# EAGLE design controller_pcb (EAGLE 7.5.0)
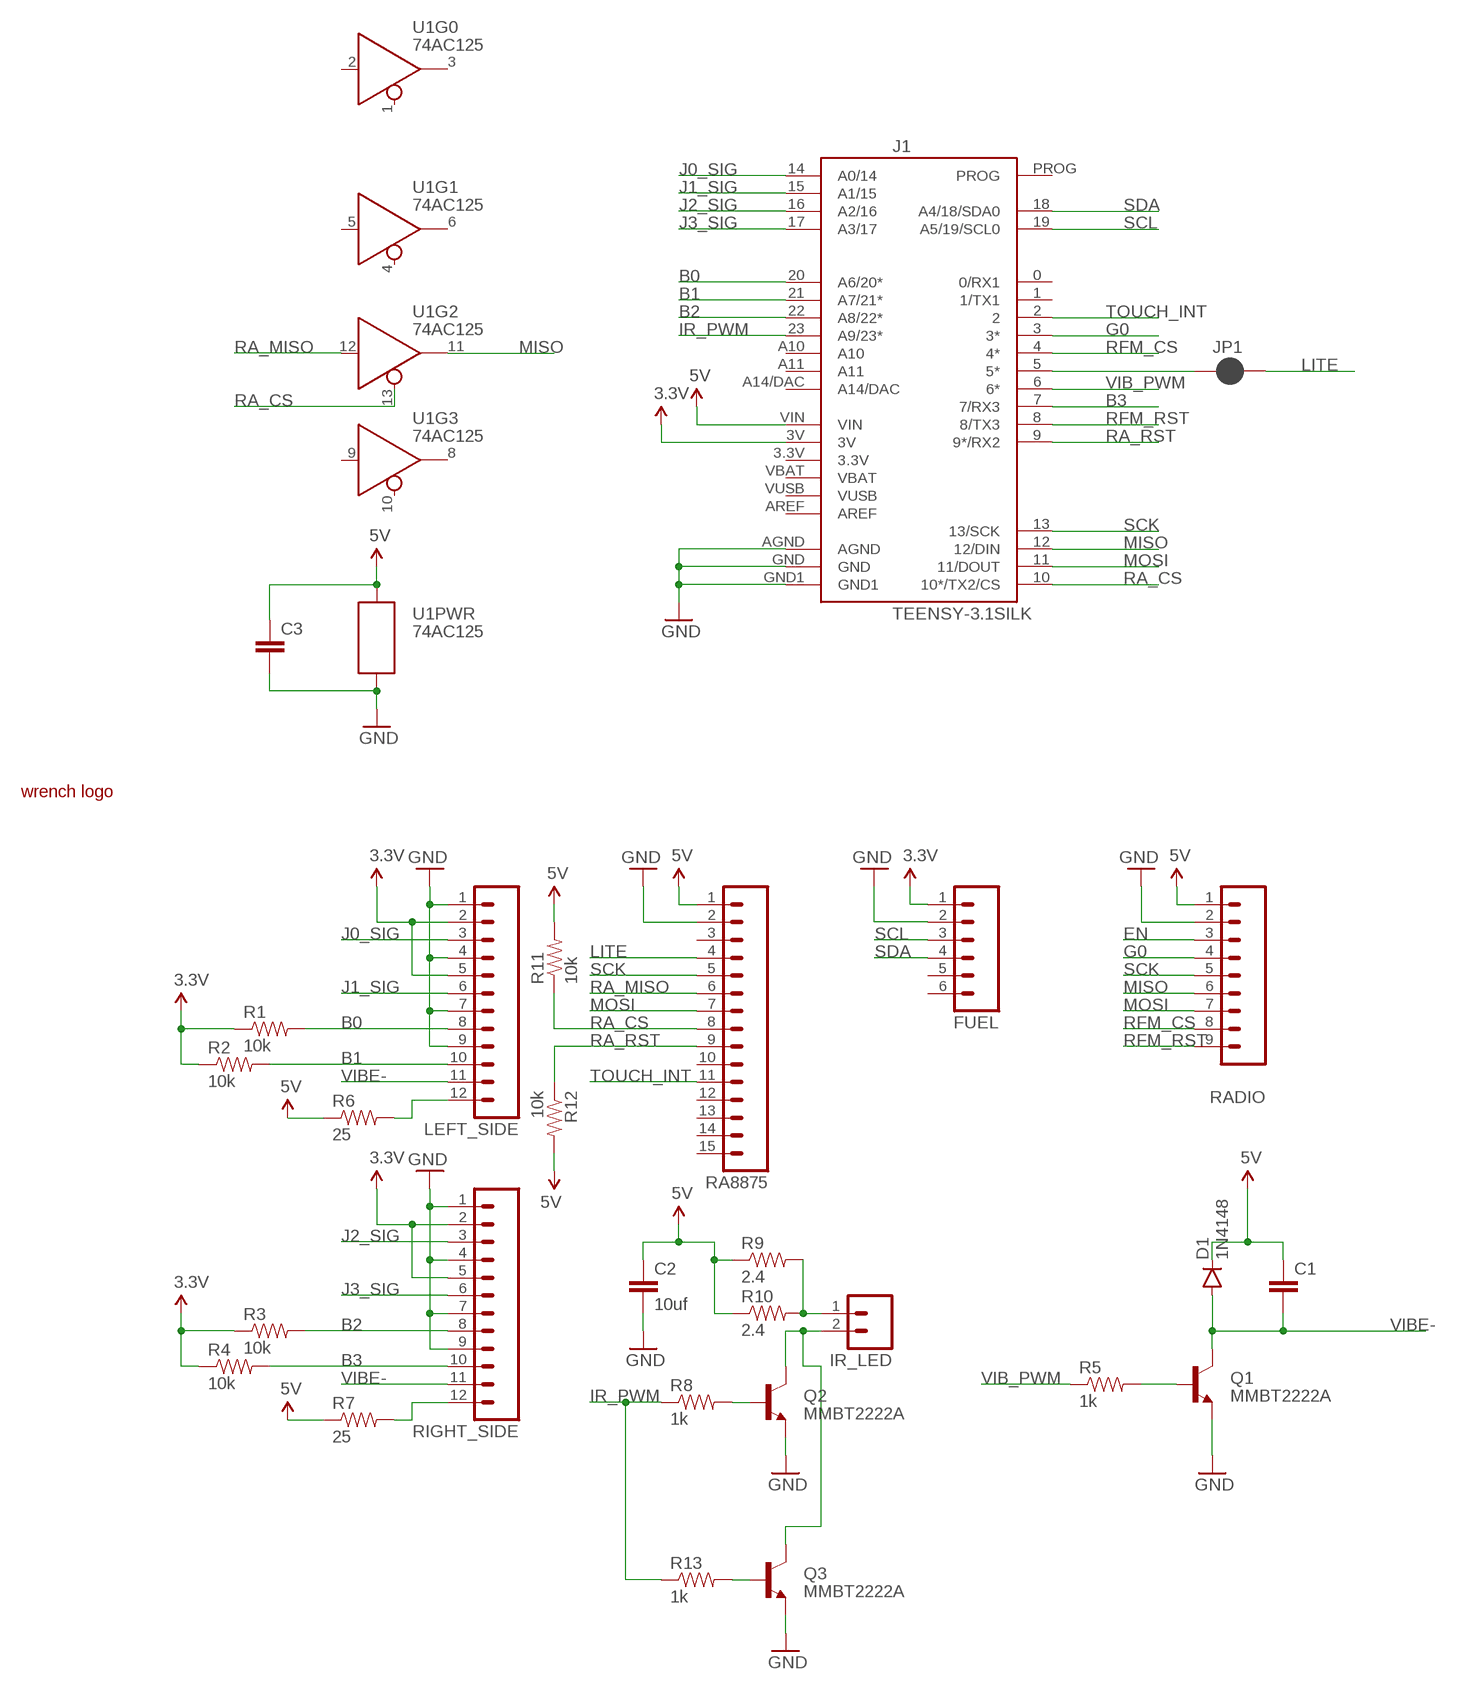
[diagram p0: schematic, sheet 1]

## Parts
C1  CAP0805  [0805]
C2  10uf  CAP1206  [1206]
C3  CAP0805  [0805]
D1  1N4148  DIODE1N4148  [DIODE-1N4148]
FUEL  M06LOCK_LONGPADS  [1X06_LOCK_LONGPADS]
IR_LED  M02PTH3  [1X02_LONGPADS]
J1  TEENSY-3.1SILK  [TEENSY-3.1]
JP1  JUMPER-PAD-2-NC_BY_PASTE  [PAD-JUMPER-2-NC_BY_PASTE_YES_SILK]
LEFT_SIDE  M12LONGPADS  [1X12_LONGPADS]
Q1  MMBT2222A  TRANSISTOR_NPNMMBT2222A  [SOT23-3]
Q2  MMBT2222A  TRANSISTOR_NPNMMBT2222A  [SOT23-3]
Q3  MMBT2222A  TRANSISTOR_NPNMMBT2222A  [SOT23-3]
R1  10k  RESISTOR0805-RES  [0805]
R2  10k  RESISTOR0805-RES  [0805]
R3  10k  RESISTOR0805-RES  [0805]
R4  10k  RESISTOR0805-RES  [0805]
R5  1k  RESISTOR0805-RES  [0805]
R6  25  RESISTOR0805-RES  [0805]
R7  25  RESISTOR0805-RES  [0805]
R8  1k  RESISTOR0805-RES  [0805]
R9  2.4  RESISTORPTH-1/2W  [AXIAL-0.5]
R10  2.4  RESISTORPTH-1/2W  [AXIAL-0.5]
R11  10k  RESISTOR0805-RES  [0805]
R12  10k  RESISTOR0805-RES  [0805]
R13  1k  RESISTOR0805-RES  [0805]
RA8875  M15LOCK_LONGPADS  [1X15_LOCK_LONGPADS]
RADIO  M09LOCK-LONGPADS  [1X09_LOCK_LONGPADS]
RIGHT_SIDE  M12LONGPADS  [1X12_LONGPADS]
U1  74AC125  74AC125DG125  [SO14]
U$1  SMALL  [WRENCHLOGO]

## Nets
3.3V: FUEL.1 J1.3V LEFT_SIDE.2 LEFT_SIDE.5 R1.1 R2.1 R3.1 R4.1 RIGHT_SIDE.2 RIGHT_SIDE.5
5V: C1.1 C2.1 C3.1 D1.C J1.VIN R6.1 R7.1 R9.P$1 R10.P$1 R11.2 R12.2 RA8875.1 RADIO.1 U1.14(PWR:P$V+)
B0: J1.20(A6/20*) LEFT_SIDE.8 R1.2
B1: J1.21(A7/21*) LEFT_SIDE.10 R2.2
B2: J1.22(A8/22*) R3.2 RIGHT_SIDE.8
B3: J1.7(7/RX3) R4.2 RIGHT_SIDE.10
EN: RADIO.3
G0: J1.3(3*) RADIO.4
GND: C2.2 C3.2 FUEL.2 J1.AGND J1.GND J1.GND1 LEFT_SIDE.1 LEFT_SIDE.4 LEFT_SIDE.7 LEFT_SIDE.9 Q1.2(E) Q2.2(E) Q3.2(E) RA8875.2 RADIO.2 RIGHT_SIDE.1 RIGHT_SIDE.4 RIGHT_SIDE.7 RIGHT_SIDE.9 U1.7(PWR:P$V-)
IR_PWM: J1.23(A9/23*) R8.1 R13.1
J0_SIG: J1.14(A0/14) LEFT_SIDE.3
J1_SIG: J1.15(A1/15) LEFT_SIDE.6
J2_SIG: J1.16(A2/16) RIGHT_SIDE.3
J3_SIG: J1.17(A3/17) RIGHT_SIDE.6
LITE: JP1.2 RA8875.4
MISO: J1.12(12/DIN) RADIO.6 U1.11(Q)
MOSI: J1.11(11/DOUT) RA8875.7 RADIO.7
N$1: J1.5(5*) JP1.1
N$2: R7.2 RIGHT_SIDE.12
N$3: LEFT_SIDE.12 R6.2
N$4: Q1.1(B) R5.2
N$5: IR_LED.2 Q2.3(C) Q3.3(C)
N$6: Q2.1(B) R8.2
N$7: IR_LED.1 R9.P$2 R10.P$2
N$9: Q3.1(B) R13.2
RA_CS: J1.10(10*/TX2/CS) R11.1 RA8875.8 U1.13(!EN)
RA_MISO: RA8875.6 U1.12(D)
RA_RST: J1.9(9*/RX2) R12.1 RA8875.9
RFM_CS: J1.4(4*) RADIO.8
RFM_RST: J1.8(8/TX3) RADIO.9
SCK: J1.13(13/SCK) RA8875.5 RADIO.5
SCL: FUEL.3 J1.19(A5/19/SCL0)
SDA: FUEL.4 J1.18(A4/18/SDA0)
TOUCH_INT: J1.2 RA8875.11
VIB_PWM: J1.6(6*) R5.1
VIBE-: C1.2 D1.A LEFT_SIDE.11 Q1.3(C) RIGHT_SIDE.11
Unconnected: FUEL.5 FUEL.6 J1.0(0/RX1) J1.1(1/TX1) J1.3.3V J1.A10 J1.A11 J1.A14/DAC J1.AREF J1.PROG J1.VBAT J1.VUSB RA8875.3 RA8875.10 RA8875.12 RA8875.13 RA8875.14 RA8875.15 U1.1(!EN) U1.2(D) U1.3(Q) U1.4(!EN) U1.5(D) U1.6(Q) U1.8(Q) U1.9(D) U1.10(!EN)

## Library data of the parts
C1-C3 = SparkFun-Capacitors:CAP: Capacitor Standard 0603 ceramic capacitor, and 0.1" leaded capacitor.
D1 = SparkFun-DiscreteSemi:DIODE: Diode These are standard reverse protection diodes and small signal diodes. SMA package can handle up to about 1A. SOD-323 can handle about 200mA. What the SOD-323 package when ordering, there are some mfgs out there that are 5-pin packages.; PROD_ID: DIO-08378
FUEL = SparkFun-Connectors:M06: Header 6 Standard 6-pin 0.1" header. Use with straight break away headers (SKU : PRT-00116), right angle break away headers (PRT-00553), swiss pins (PRT-00743), machine pins (PRT-00117), and female headers (PRT-00115). Molex polarized connector foot print use with SKU : PRT-08094 with associated crimp pins and housings. NOTES ON THE VARIANTS LOCK and LOCK_LONGPADS... This footprint was designed to help hold the alignment of a through-hole component (i.e. 6-pin header) while soldering it into place. You may notice that each hole has been shifted either up or down by 0.005 of an inch from it's more standard position (which is a perfectly straight line). This slight alteration caused the pins (the squares in the middle) to touch the edges of the holes. Because they are alternating, it causes a "brace" to hold the component in place. 0.005 has proven to be the perfect amount of "off-center" position when using our standard breakaway headers. Although looks a little odd when you look at the bare footprint, once you have a header in there, the alteration is very hard to notice. Also,if you push a header all the way into place, it is covered up entirely on the bottom side. This idea of altering the position of holes to aid alignment will be further integrated into the Sparkfun Library for other footprints. It can help hold any component with 3 or more connection pins.
IR_LED = SparkFun-Connectors:M02: Standard 2-pin 0.1" header. Use with - straight break away headers ( PRT-00116) - right angle break away headers (PRT-00553) - swiss pins (PRT-00743) - machine pins (PRT-00117) - female headers (PRT-00115) Molex polarized connector foot print use with: PRT-08233 with associated crimp pins and housings. 2.54_SCREWTERM for use with PRT-10571. 3.5mm Screw Terminal footprints for PRT-08084 5mm Screw Terminal footprints for use with PRT-08432
J1 = SparkFun-Boards:TEENSY-3.1; SF_ID: DEV-12646
JP1 = SparkFun-Passives:JUMPER-PAD-2-NC_BY_PASTE
LEFT_SIDE RIGHT_SIDE = SparkFun-Connectors:M12: Header 12 Standard 12-pin 0.1" header. Use with straight break away headers (SKU : PRT-00116), right angle break away headers (PRT-00553), swiss pins (PRT-00743), machine pins (PRT-00117), and female headers (PRT-00115).
Q1-Q3 = SparkFun-DiscreteSemi:TRANSISTOR_NPN: Generic NPN BJT MMBT2222A - TRANS-08049 (SOT-23, 1A 40V) MPSA42 - TRANS-09116 (SOT-23, 500mA 300V) MMBT5088LT1G - TRANS-11160 (SOT-23, 50 mA 30V) BC547 - COM-08928 <http://www.sparkfun.com/products/8928> (TO-92 45V 100mA) (1.Collector 2.Base 3.Emitter) 2N3904 - COM-00521 <http://www.sparkfun.com/products/521> (TO-92 40V 200mA) (1.Emitter 2.Base 3.Collector) P2N2222A - COM-12852 <http://www.sparkfun.com/products/12852> (TO-92 40V 600mA) (1.Collector 2.Base 3.Emitter); PROD_ID: TRANS-08049
R1-R13 = SparkFun-Passives:RESISTOR: Resistor Basic schematic elements and footprints for 0603, 1206, and PTH resistors.
RA8875 = SparkFun-Connectors:M15: Header 15 Standard 15-pin 0.1" header. Use with straight break away headers (SKU : PRT-00116), right angle break away headers (PRT-00553), swiss pins (PRT-00743), machine pins (PRT-00117), and female headers (PRT-00115).
RADIO = SparkFun-Connectors:M09: Header 9 Standard 9-pin 0.1" header. Use with straight break away headers (SKU : PRT-00116), right angle break away headers (PRT-00553), swiss pins (PRT-00743), machine pins (PRT-00117), and female headers (PRT-00115).
U1 = SparkFun-DigitalIC:74*125; PROD_ID: IC-08880
U$1 = logos-and-graphics:SMALL

## Board
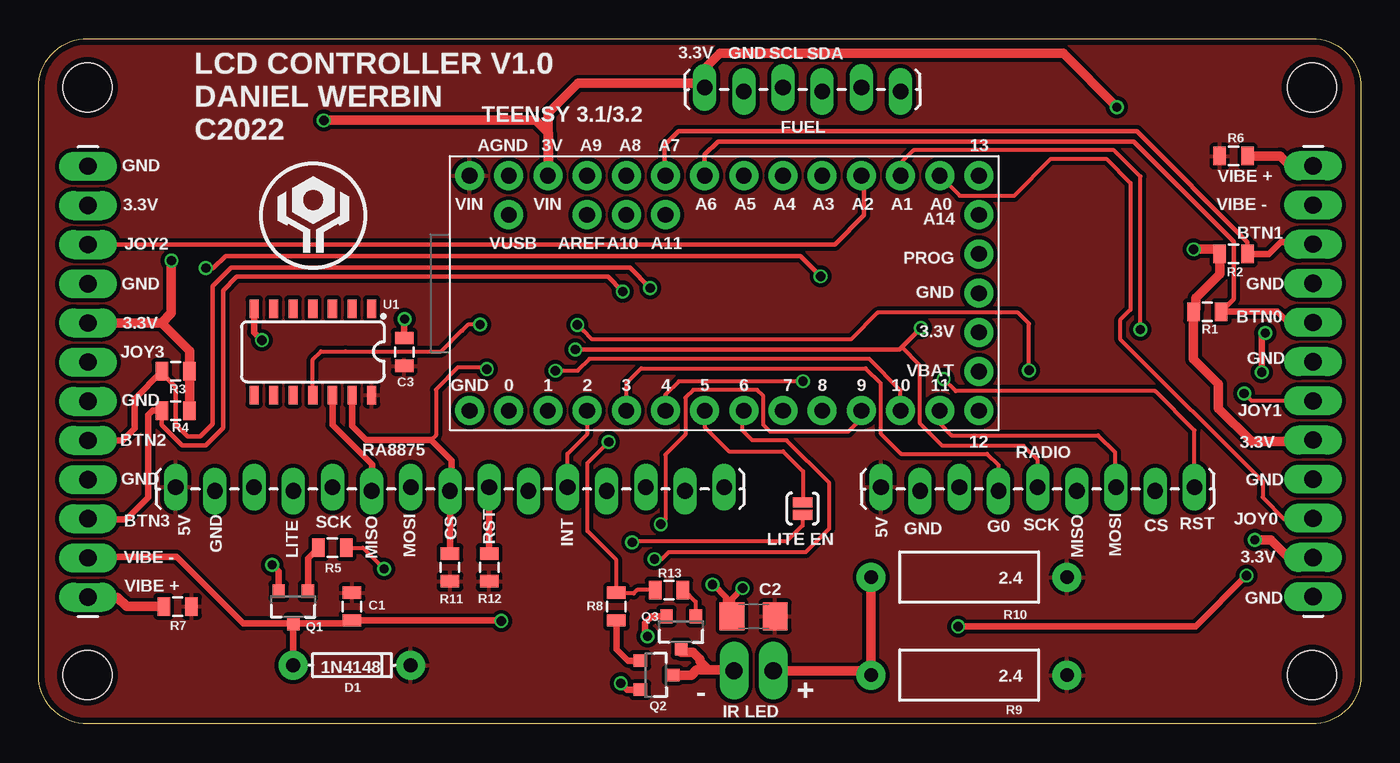
[diagram p1: board, top side]
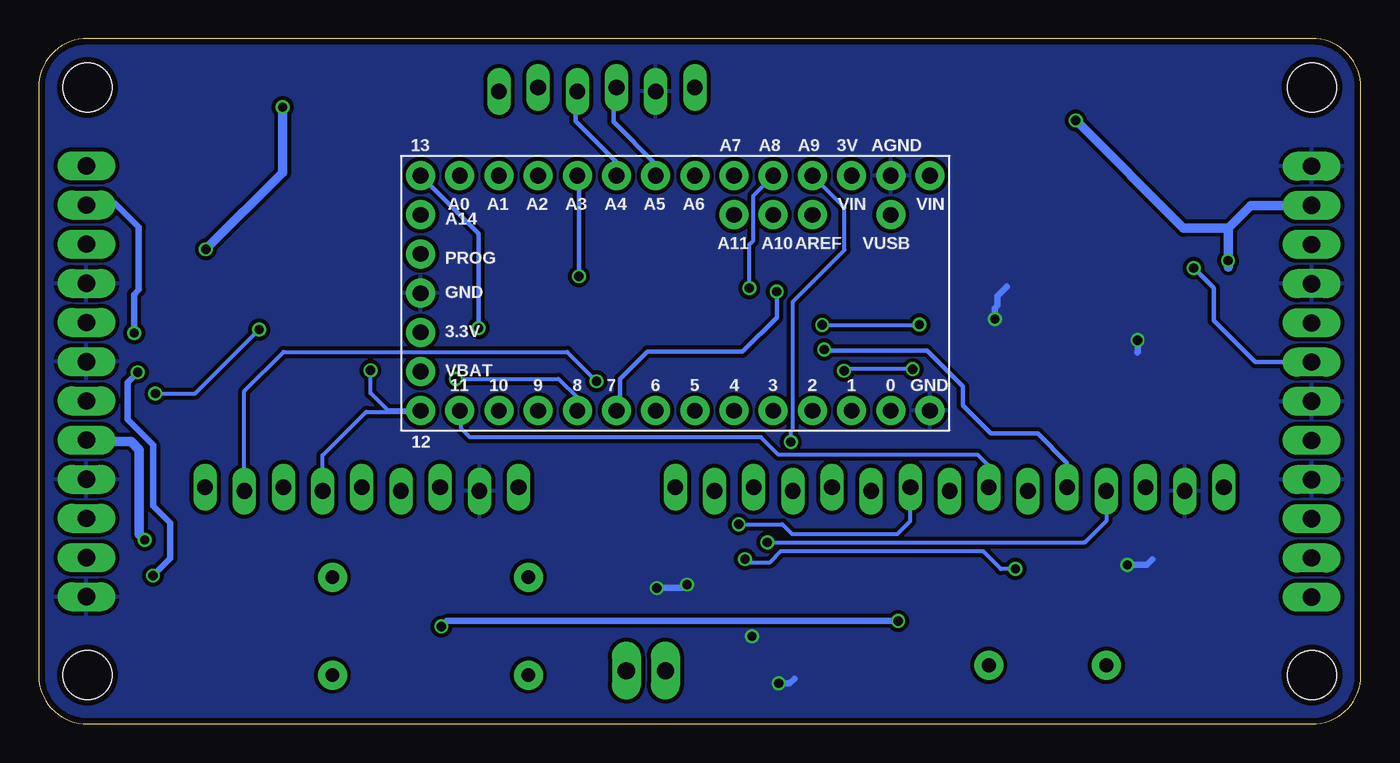
[diagram p2: board, bottom side, seen from below]

Size 85.72 x 44.45 mm. Coordinates in mm from the lower left corner, seen from the top.
Outline: 3.17,0 arc-90 0,3.17 0,41.27 arc-90 3.17,44.45 82.55,44.45 arc-90 85.72,41.27 85.72,3.17 arc-90 82.55,0 3.17,0
Copper layers (1*16): Top 0.035559375mm / dielectric 1.6mm / Bottom 0.035559375mm
Design rules "oshpark-2layer": minimum track width 6mil, minimum drill 10mil, track to track 6mil, track to pad 6mil, pad to pad 6mil, via to via 6mil, smd to smd 6mil, copper to edge 15mil, drill to drill 6mil, minimum pad ring 5mil, minimum via ring 5mil, stop-mask expansion 2.5mil, vias tented up to drill 0mil, thermal gap 10mil
Holes 3.17 mm at 3.17,41.27 3.17,3.17 82.55,3.17 82.55,41.27

### Footprints (pad centres in the part's own frame; a part is rotated, then mirrored left to right if it is on the bottom)
0805 = smd 0.8 x 1.2: 1 -0.9,0; 2 0.9,0
1206 = smd 1.6 x 1.8: 1 -1.4,0; 2 1.4,0
DIODE-1N4148 = drill 0.9 pad 1.88: A -3.81,0; C 3.81,0
1X06_LOCK_LONGPADS = drill 1.016 long: 1 0,0; 2 2.54,-0.254; 3 5.08,0; 4 7.62,-0.254; 5 10.16,0; 6 12.7,-0.254
1X02_LONGPADS = drill 1.118 pad 1.88 long: 1 0,0; 2 2.54,0
TEENSY-3.1 = drill 1.016 pad 1.88: 0 16.51,3.81; 1 16.51,6.35; 2 16.51,8.89; 3 16.51,11.43; 3.3V 11.43,34.29; 3V 1.27,6.35; 4 16.51,13.97; 5 16.51,16.51; 6 16.51,19.05; 7 16.51,21.59; 8 16.51,24.13; 9 16.51,26.67; 10 16.51,29.21; 11 16.51,31.75; 12 16.51,34.29; 13 1.27,34.29; 14 1.27,31.75; 15 1.27,29.21; 16 1.27,26.67; 17 1.27,24.13; 18 1.27,21.59; 19 1.27,19.05; 20 1.27,16.51; 21 1.27,13.97; 22 1.27,11.43; 23 1.27,8.89; A10 3.81,11.43; A11 3.81,13.97; A14/DAC 3.81,34.29; AGND 1.27,3.81; AREF 3.81,8.89; GND 8.89,34.29; GND1 16.51,1.27; PROG 6.35,34.29; VBAT 13.97,34.29; VIN 1.27,1.27; VUSB 3.81,3.81
PAD-JUMPER-2-NC_BY_PASTE_YES_SILK = smd 0.635 x 1.27: 1 -0.401,0; 2 0.413,0
1X12_LONGPADS = drill 1.118 pad 1.88 long: 1 0,0; 2 2.54,0; 3 5.08,0; 4 7.62,0; 5 10.16,0; 6 12.7,0; 7 15.24,0; 8 17.78,0; 9 20.32,0; 10 22.86,0; 11 25.4,0; 12 27.94,0
SOT23-3 = smd 0.8 x 0.9: 1 -0.95,-1; 2 0.95,-1; 3 0,1.1
AXIAL-0.5 = drill 0.9 pad 1.88: P$1 -6.35,0; P$2 6.35,0
1X15_LOCK_LONGPADS = drill 1.016 long: 1 0,0.127; 2 2.54,-0.127; 3 5.08,0.127; 4 7.62,-0.127; 5 10.16,0.127; 6 12.7,-0.127; 7 15.24,0.127; 8 17.78,-0.127; 9 20.32,0.127; 10 22.86,-0.127; 11 25.4,0.127; 12 27.94,-0.127; 13 30.48,0.127; 14 33.02,-0.127; 15 35.56,0.127
1X09_LOCK_LONGPADS = drill 1.016 long: 1 0,0.127; 2 2.54,-0.127; 3 5.08,0.127; 4 7.62,-0.127; 5 10.16,0.127; 6 12.7,-0.127; 7 15.24,0.127; 8 17.78,-0.127; 9 20.32,0.127
SO14 = smd 0.6 x 1.2: 1 -3.81,-2.8; 2 -2.54,-2.8; 3 -1.27,-2.8; 4 0,-2.8; 5 1.27,-2.8; 6 2.54,-2.8; 7 3.81,-2.8; 8 3.81,2.8; 9 2.54,2.8; 10 1.27,2.8; 11 0,2.8; 12 -1.27,2.8; 13 -2.54,2.8; 14 -3.81,2.8

### Placement (x,y rotation side)
C1  20.32,7.62 270 top
C2  46.35,6.98 180 top
C3  23.7,24.13 90 top
D1  20.32,3.81 0 top
FUEL  43.18,41.27 0 top
IR_LED  47.62,3.45 180 top
J1  26.67,36.83 270 top
JP1  49.53,13.97 270 top
LEFT_SIDE  82.63,8.25 90 top
Q1  16.51,7.62 180 top
Q2  40.01,3.17 270 top
Q3  41.66,5.99 180 top
R1  75.77,26.75 0 top
R2  77.47,30.48 0 top
R3  8.89,22.86 180 top
R4  8.89,20.32 180 top
R5  19.05,11.43 180 top
R6  77.47,36.83 0 top
R7  9.02,7.62 180 top
R8  37.47,7.62 270 top
R9  60.33,3.17 180 top
R10  60.33,9.52 180 top
R11  26.67,10.16 270 top
R12  29.21,10.16 270 top
R13  40.87,8.69 0 top
RA8875  8.89,15.24 0 top
RADIO  54.61,15.24 0 top
RIGHT_SIDE  3.2,36.17 270 top
U1  17.78,24.13 180 top
U$1  13.97,29.21 0 top

### Tracks (layer width: path | path; a pad name or v marks a point on that pad's centre or on a via)
3.3V  (via drill 0.6)
  Top 0.61: 7.98,26.01 9.79,24.2 R3.1 R4.1 | v18.49,39.14 32.23,39.14 33.05,38.33 33.05,35.59 J1.3V 33.02,39.6 34.98,41.55 42.9,41.55 FUEL.1 43.18,42.49 44.17,43.48 66.42,43.48 v69.9,40 | v74.88,30.79 76.27,30.79 R2.1 76.57,29.17 75.03,27.63 75.03,26.91 R1.1 74.87,23.66 76.48,22.05 76.48,20.47 78.64,18.31 82.53,18.31 LEFT_SIDE.5 | v78.84,11.94 79.88,11.94 81.2,10.62 82.45,10.62 LEFT_SIDE.2 | 7.98,26.01 RIGHT_SIDE.5 | v8.61,30.05 8.61,26.64 7.98,26.01
  Bottom 0.61: 8.59,32.16 7.14,33.6 4.22,33.6 4.14,33.68 3.25,33.68 RIGHT_SIDE.2 | 8.59,32.16 11.51,32.16 v18.49,39.14 | v69.9,40 69.9,35.76 v74.88,30.79 | LEFT_SIDE.5 82.53,18.31 79.73,18.31 79.2,17.78 79.2,12.29 v78.84,11.94 | 8.59,32.16 8.59,29.64 v8.61,30.05
5V
  pour Top (isolate 0.254): 1.27,0 0,1.27 0,43.18 1.27,44.45 85.09,44.45 86.36,43.18 86.36,1.27 85.09,0
B0
  Top 0.305: J1.20 43.18,36.91 44.04,37.77 71.02,37.77 77.5,31.29 77.5,27.55 R1.2
  Top 0.406: R1.2 80.29,26.75 81.08,25.96 82.55,25.96 LEFT_SIDE.8
B1
  Top 0.305: R2.2 78.37,31.26 71.2,38.43 41.48,38.43 40.59,37.54 40.59,35.61 J1.21
  Top 0.406: R2.2 79.76,30.48 80.54,31.27 82.47,31.27 LEFT_SIDE.10
B2  (via drill 0.6)
  Top 0.305: R3.2 7.99,22.77 8.89,21.87 8.89,19.41 9.65,18.64 10.49,18.64 11.3,19.46 11.3,28.4 12.5,29.59 38.33,29.59 v39.65,28.27
  Top 0.406: RIGHT_SIDE.8 5.46,18.39 6.22,19.15 6.22,21.09 R3.2
  Bottom 0.254: v39.65,28.27 39.65,31.09 39.4,31.34 39.4,34.27 J1.22
B3  (via drill 0.6)
  Top 0.305: R4.2 7.99,19.39 9.32,18.06 10.82,18.06 11.96,19.2 11.96,28.12 12.85,29.01 36.91,29.01 v37.87,28.04
  Top 0.406: R4.2 7.39,20.32 7.11,20.04 7.11,14.71 5.69,13.28 3.23,13.28 RIGHT_SIDE.10
  Bottom 0.305: v37.87,28.04 37.87,26.36 40.08,24.16 46.25,24.16 48.03,22.38 48.03,20.55 J1.7
G0
  Top 0.254: J1.3 38.1,22.1 39.06,23.06 53.62,23.06 54.59,22.1 54.59,18.85 55.91,17.53 61.49,17.53 62.23,16.79 RADIO.4
GND  (via drill 0.6)
  Top 0.406: U1.7 13.97,25.4 v14.48,24.89 | C3.2 23.7,26.24 v23.72,26.26 | Q1.2 15.56,9.89 v15.14,10.31 | C2.2 44.95,8.12 v45.64,8.81 | v43.69,9.04 43.76,9.04 44.58,8.23 44.58,7.21 44.86,6.93 | Q2.2 38.16,2.22 v37.74,2.64 | Q3.2 39.76,6.99 39.32,6.55 39.32,5.84 v39.47,5.69
  Bottom 0.406: v14.48,24.89 14.48,24.13 14.5,24.1 | v23.72,26.26 23.72,26.98 23.57,27.13 23.57,27.76 22.96,28.37 | v15.14,10.31 13.87,10.31 13.51,10.67 | v45.64,8.81 43.92,8.81 v43.69,9.04 | v37.74,2.64 37.03,2.64 36.73,2.95 | v39.47,5.69 39.45,5.69 39.29,5.54
  pour Bottom (isolate 0.254): 2.54,0 1.27,0 0,1.27 0,43.18 1.27,44.45 85.09,44.45 86.36,43.18 86.36,1.27 85.09,0
IR_PWM  (via drill 0.6)
  Top 0.254: v36.96,18.29 35.59,16.92 35.59,12.52 37.47,10.64 R8.1 37.53,8.46 38.58,8.46 38.81,8.69 R13.1
  Bottom 0.254: v36.96,18.29 36.96,18.97 36.83,19.1 36.83,27.38 33.48,30.73 33.48,33.48 J1.23
J0_SIG
  Top 0.254: J1.14 59.72,34.27 63.25,34.27 65.63,36.65 69.22,36.65 70.79,35.08 70.79,26.87 70.1,26.19 70.1,24.97 79.35,15.72 79.35,14.71 80.77,13.28 82.58,13.28 LEFT_SIDE.3
J1_SIG  (via drill 0.6)
  Top 0.254: LEFT_SIDE.6 78.64,20.95 v78.16,21.44 | v71.42,25.58 71.42,35.51 69.72,37.21 56.72,37.21 55.93,36.42 55.93,35.61 J1.15
  Bottom 0.254: v78.16,21.44 75.56,21.44 v71.42,25.58
J2_SIG
  Top 0.305: RIGHT_SIDE.3 51.61,31.09 53.52,33 53.52,34.9 53.7,35.08 53.7,35.2 J1.16
J3_SIG  (via drill 0.6)
  Top 0.305: v10.85,29.57 11.33,29.57 12.12,30.35 49.38,30.35 v50.7,29.03
  Bottom 0.305: RIGHT_SIDE.6 6.86,23.47 9.55,26.16 9.55,28.27 v10.85,29.57 | v50.7,29.03 50.7,35.46 J1.17
LITE  (via drill 0.6)
  Top 0.254: JP1.2 49.53,12.88 48.49,11.84 38.53,11.84 v38.48,11.79
  Bottom 0.254: v38.48,11.79 17.91,11.79 16.48,13.21 16.48,15.62 16.51,15.65 RA8875.4
MISO  (via drill 0.6)
  Top 0.254: v64.21,22.94 64.21,25.96 63.5,26.67 54.38,26.67 52.65,24.94 35.89,24.94 35.33,25.5 35.31,25.5 v34.92,25.88 | v28.63,25.91 27.91,25.91 27.89,25.93 27.46,25.5 27.43,25.5 26.06,24.13 19.91,24.13 19.89,24.16 18.31,24.16 17.78,23.62 U1.11
  Bottom 0.254: RADIO.6 67.31,17.42 64.49,20.24 61.04,20.24 J1.12 63.07,20.32 64.21,21.46 v64.21,22.94 | v34.92,25.88 28.65,25.88 v28.63,25.91
MOSI
  Top 0.254: J1.11 58.42,19.48 59.18,18.72 68.68,18.72 69.77,17.63 69.77,15.44 RADIO.7
  Bottom 0.254: RA8875.7 24.13,16.74 24.84,17.45 37.74,17.45 38.89,18.59 57.76,18.59 58.32,19.15 58.32,20.22 J1.11
N$1
  Top 0.254: J1.5 43.18,19.25 44.76,17.68 48.26,17.68 49.55,16.38 49.55,14.4 JP1.1
N$2
  Top 0.61: RIGHT_SIDE.12 5.11,8.23 5.71,7.62 R7.2
N$3
  Top 0.61: R6.2 80.49,36.83 81.28,36.04 82.47,36.04 LEFT_SIDE.12
N$4
  Top 0.406: Q1.1 17.46,10.74 R5.2
N$5
  Top 0.406: Q3.3 41.66,4.65
  Top 0.61: Q2.3 42.32,3.17 42.65,3.5 43.43,3.5 | 43.43,3.5 45.03,3.5 IR_LED.2 | 41.66,4.65 42.42,4.65 42.88,4.19 42.88,4.06 43.43,3.5
N$6
  Top 0.406: R8.2 37.47,4.85 38.2,4.11 38.99,4.11 Q2.1
N$7
  Top 0.61: IR_LED.1 53.7,3.45 R9.P$2 R10.P$2
N$9
  Top 0.254: R13.2 41.83,8.69 42.6,7.92 42.6,7 Q3.1
RA_CS  (via drill 0.6)
  Top 0.254: J1.10 55.88,21.64 53.85,23.67 35.71,23.67 34.95,22.91 v33.5,22.91 | 25.45,18.41 25.76,18.72 25.76,21.69 27.2,23.14 28.93,23.14 v29.06,23.01
  Top 0.406: U1.13 20.32,19.33 21.23,18.41 25.45,18.41 26.77,17.09 26.77,15.21 RA8875.8 R11.1
  Bottom 0.254: v29.06,23.01 33.4,23.01 v33.5,22.91
RA_MISO
  Top 0.406: U1.12 19.05,19.41 21.61,16.84 21.61,15.14 RA8875.6
RA_RST  (via drill 0.6)
  Top 0.254: J1.9 53.34,19.81 52.48,18.95 47.45,18.95 46.99,19.41 46.99,21.26 46.58,21.67 42.44,21.67 41.94,21.16 41.94,18.77 40.64,17.48 40.64,13.26 v40.34,12.95
  Top 0.406: R12.1 RA8875.9
  Bottom 0.254: v40.34,12.95 37.52,12.95 36.88,12.32 30.05,12.32 29.21,13.16 RA8875.9
RFM_CS  (via drill 0.6)
  Top 0.254: v49.55,22.23 41.5,22.23 40.64,21.36 J1.4
  Bottom 0.254: RADIO.8 72.39,21.59 69.85,24.13 51.46,24.13 v49.55,22.23
RFM_RST  (via drill 0.6)
  Top 0.254: RADIO.9 74.93,19.05 72.39,21.59 59.46,21.59 v58.67,22.38
  Bottom 0.254: v58.67,22.38 52.02,22.38 50.8,21.16 J1.8 | J1.8 50.8,19.76 50.7,19.66 50.7,20.22 J1.8
SCK  (via drill 0.6)
  Top 0.254: RADIO.5 64.77,17.12 63.86,18.03 58.6,18.03 57.15,19.48 57.15,23.24 55.96,24.43
  Top 0.305: v34.8,24.28 55.8,24.28 55.96,24.43 v57.2,25.68
  Bottom 0.305: RA8875.5 19.05,16.94 20.95,18.85 24,18.85 25.81,20.65 25.81,21.89 28.14,24.23 34.75,24.23 v34.8,24.28 | v57.2,25.68 57.2,31.8 J1.13
SCL
  Bottom 0.305: J1.19 45.72,36.32 48.46,39.06 48.46,41.07 FUEL.3
SDA
  Bottom 0.305: J1.18 48.26,36.45 50.9,39.09 50.9,40.92 FUEL.4
TOUCH_INT
  Top 0.254: RA8875.11 34.29,17.53 35.59,18.82 35.59,20.29 J1.2
VIB_PWM  (via drill 0.6)
  Top 0.254: R5.1 21.03,11.43 v22.4,10.06 | v39.93,10.69 40.41,10.69 40.87,11.15 49.73,11.15 51.26,12.67 51.26,15.62 48.49,18.39 46.28,18.39 45.64,19.02 45.64,20.24 J1.6
  Bottom 0.254: v22.4,10.06 23.34,10.06 24.49,11.2 37.62,11.2 38.35,10.46 39.7,10.46 v39.93,10.69
VIBE-  (via drill 0.6)
  Top 0.406: D1.A Q1.3 | Q1.3 13.27,6.52 8.94,10.85 3.28,10.85 RIGHT_SIDE.11 | Q1.3 20.12,6.52 C1.2 29.96,6.72 v30,6.68 | v59.61,6.32 75.01,6.32 v78.31,9.63 | v79.3,22.81 79.3,25.12 v79.53,25.35
  Bottom 0.406: v30,6.68 59.26,6.68 v59.61,6.32 | LEFT_SIDE.11 82.8,33.48 83.21,33.48 83.08,33.6 82.07,33.6 81.92,33.76 80.77,33.76 79.22,32.21 79.22,28.17 79.53,27.86 v79.53,25.35 | v79.3,22.81 79.96,22.15 79.96,19.74 78.31,18.09 78.31,14.15 77.19,13.03 77.19,10.74 v78.31,9.63

### Text on the board
tPlace: 3.3V | GND | SCL | SDA | TEENSY 3.1/3.2 | FUEL | LCD CONTROLLER V1.0 / DANIEL WERBIN / C2022 | R6 | GND | VIBE + | 3.3V | VIBE - | BTN1 | JOY2 | R2 | GND | GND | U1 | 3.3V | R1 | BTN0 | JOY3 | GND | R3 | C3 | GND | JOY1 | R4 | BTN2 | RA8875 | RADIO | 3.3V | GND | GND | BTN3 | 5V | SCK | GND | G0 | SCK | CS | RST | JOY0 | CS | RST | INT | LITE EN | 5V | VIBE - | GND | LITE | MISO | MOSI | MISO | MOSI | 3.3V | R5 | R13 | VIBE + | C2 | C1 | R11 | R12 | R8 | GND | Q3 | R10 | R7 | Q1 | D1 | - | + | Q2 | IR LED | R9